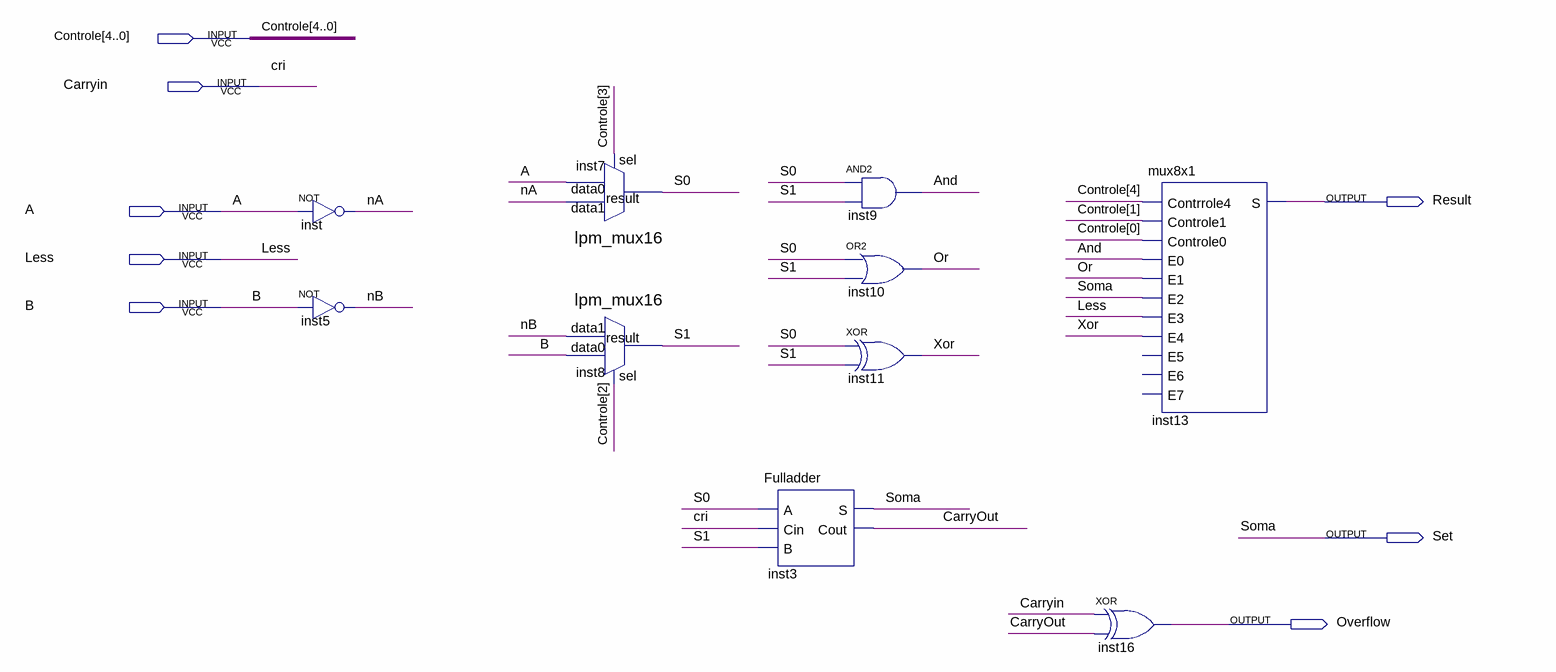
[diagram p0: schematic sheet]
// Quartus schematic BitM.bdf as structural Verilog: 10 symbols, 8 pins
module BitM (
  input  [4:0] Controle,
  input  Carryin,
  input  A,
  input  Less,
  input  B,
  output Result,
  output Set,
  output Overflow
);

  wire And, CarryOut, nA, nB, Or, S0, S1, Xor;

  not inst (nA, A);
  not inst5 (nB, B);
  lpm_mux16 inst7 (.data1(nA), .data0(A), .sel(Controle[3]), .result(S0));
  lpm_mux16 inst8 (.data1(nB), .data0(B), .sel(Controle[2]), .result(S1));
  Fulladder inst3 (.A(S0), .Cin(Carryin), .B(S1), .S(Set), .Cout(CarryOut));
  and inst9 (And, S0, S1);
  or inst10 (Or, S0, S1);
  xor inst11 (Xor, S0, S1);
  mux8x1 inst13 (
    .Contrrole4(Controle[4]), .Controle1(Controle[1]), .Controle0(Controle[0]), .E0(And), .E1(Or), .E2(Set),
    .E3(Less), .E4(Xor), .S(Result));  // open: E5, E6, E7
  xor inst16 (Overflow, Carryin, CarryOut);

  // Other names for the same wires on the sheet: cri = Carryin; Soma = Set
endmodule
